# Altium schematic sheet CPU.SchDoc
size A4; SheetNumber: 3; SheetTotal: 11
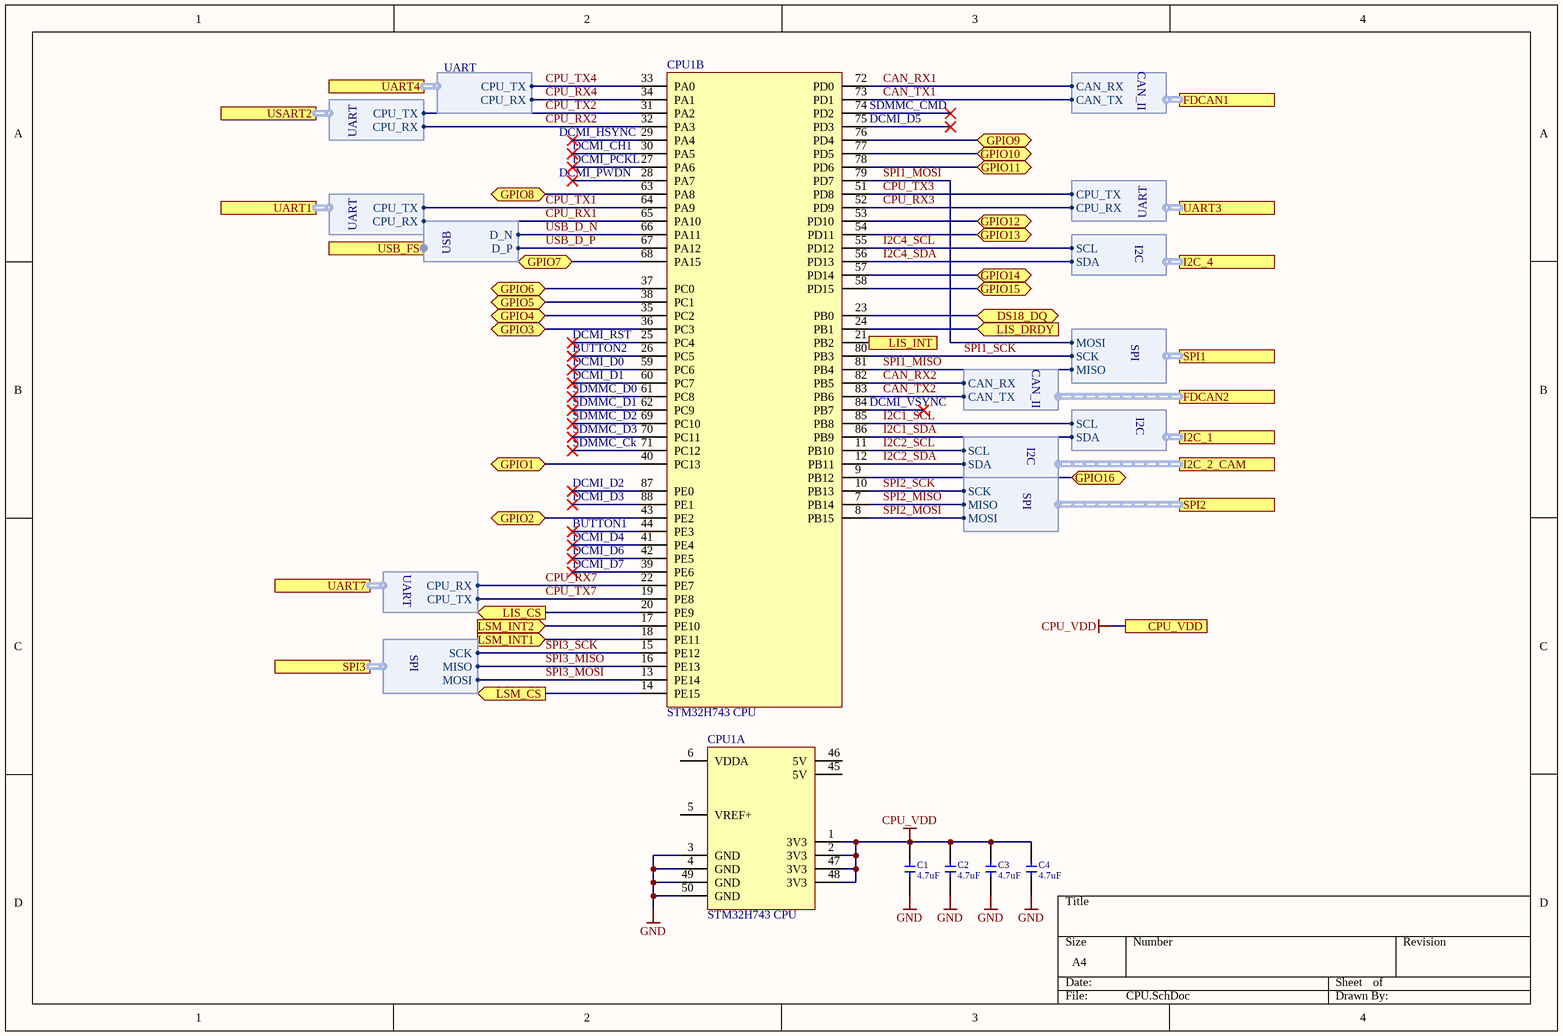
[diagram p0: CPU.SchDoc]

## Parts
C1  value 4.7uF  [CERCAP 0603]
C2  value 4.7uF  [CERCAP 0603]
C3  value 4.7uF  [CERCAP 0603]
C4  value 4.7uF  [CERCAP 0603]
CPU1  STM32H743 CPU  [STM32H7_CPU]  (parts A,B of 2)

## Ports
CPU_VDD, DS18_DQ (bidir), FDCAN1 (harness CAN_II), FDCAN2 (harness CAN_II), GPIO1 (bidir), GPIO2 (bidir), GPIO3 (bidir), GPIO4 (bidir), GPIO5 (bidir), GPIO6 (bidir), GPIO7 (bidir), GPIO8 (bidir), GPIO9 (bidir), GPIO10 (bidir), GPIO11 (bidir), GPIO12 (bidir), GPIO13 (bidir), GPIO14 (bidir), GPIO15 (bidir), GPIO16 (bidir), I2C_1 (harness I2C), I2C_2_CAM (harness I2C), I2C_4 (harness I2C), LIS_CS (out), LIS_DRDY (in), LIS_INT (in), LSM_CS (out), LSM_INT1 (in), LSM_INT2 (in), SPI1 (harness SPI), SPI2 (harness SPI), SPI3 (harness SPI), UART1 (harness UART), UART3 (harness UART), UART4 (harness UART), UART7 (harness UART), USART2 (harness UART), USB_FS (harness USB)

## Harnesses
I2C: SDA, SCL
CAN_II: CAN_RX, CAN_TX
SPI: MOSI, SCK, MISO
USB: D_N, D_P
UART: CPU_RX, CPU_TX

## Nets
CPU_VDD: C1.2 C2.2 C3.2 C4.2 CPU1.1(3V3) CPU1.2(3V3) CPU1.47(3V3) CPU1.48(3V3) ; port CPU_VDD
GND: C1.1 C2.1 C3.1 C4.1 CPU1.3(GND) CPU1.4(GND) CPU1.49(GND) CPU1.50(GND)
CAN_RX1: CPU1.72(PD0) ; port FDCAN1.CAN_RX
CAN_RX2: CPU1.82(PB5) ; port FDCAN2.CAN_RX
CAN_TX1: CPU1.73(PD1) ; port FDCAN1.CAN_TX
CAN_TX2: CPU1.83(PB6) ; port FDCAN2.CAN_TX
CPU_RX1: CPU1.65(PA10) ; port UART1.CPU_RX
CPU_RX2: CPU1.32(PA3) ; port USART2.CPU_RX
CPU_RX3: CPU1.52(PD9) ; port UART3.CPU_RX
CPU_RX4: CPU1.34(PA1) ; port UART4.CPU_RX
CPU_RX7: CPU1.22(PE7) ; port UART7.CPU_RX
CPU_TX1: CPU1.64(PA9) ; port UART1.CPU_TX
CPU_TX2: CPU1.31(PA2) ; port USART2.CPU_TX
CPU_TX3: CPU1.51(PD8) ; port UART3.CPU_TX
CPU_TX4: CPU1.33(PA0) ; port UART4.CPU_TX
CPU_TX7: CPU1.19(PE8) ; port UART7.CPU_TX
DS18_DQ: CPU1.23(PB0) ; port DS18_DQ
GPIO1: CPU1.40(PC13) ; port GPIO1
GPIO2: CPU1.43(PE2) ; port GPIO2
GPIO3: CPU1.36(PC3) ; port GPIO3
GPIO4: CPU1.35(PC2) ; port GPIO4
GPIO5: CPU1.38(PC1) ; port GPIO5
GPIO6: CPU1.37(PC0) ; port GPIO6
GPIO7: CPU1.68(PA15) ; port GPIO7
GPIO8: CPU1.63(PA8) ; port GPIO8
GPIO9: CPU1.76(PD4) ; port GPIO9
GPIO10: CPU1.77(PD5) ; port GPIO10
GPIO11: CPU1.78(PD6) ; port GPIO11
GPIO12: CPU1.53(PD10) ; port GPIO12
GPIO13: CPU1.54(PD11) ; port GPIO13
GPIO14: CPU1.57(PD14) ; port GPIO14
GPIO15: CPU1.58(PD15) ; port GPIO15
GPIO16: CPU1.9(PB12) ; port GPIO16
I2C1_SCL: CPU1.85(PB8) ; port I2C_1.SCL
I2C1_SDA: CPU1.86(PB9) ; port I2C_1.SDA
I2C2_SCL: CPU1.11(PB10) ; port I2C_2_CAM.SCL
I2C2_SDA: CPU1.12(PB11) ; port I2C_2_CAM.SDA
I2C4_SCL: CPU1.55(PD12) ; port I2C_4.SCL
I2C4_SDA: CPU1.56(PD13) ; port I2C_4.SDA
LIS_CS: CPU1.20(PE9) ; port LIS_CS
LIS_DRDY: CPU1.24(PB1) ; port LIS_DRDY
LIS_INT: CPU1.21(PB2) ; port LIS_INT
LSM_CS: CPU1.14(PE15) ; port LSM_CS
LSM_INT1: CPU1.18(PE11) ; port LSM_INT1
LSM_INT2: CPU1.17(PE10) ; port LSM_INT2
SPI1_MISO: CPU1.81(PB4) ; port SPI1.MISO
SPI1_MOSI: CPU1.79(PD7) ; port SPI1.MOSI
SPI1_SCK: CPU1.80(PB3) ; port SPI1.SCK
SPI2_MISO: CPU1.7(PB14) ; port SPI2.MISO
SPI2_MOSI: CPU1.8(PB15) ; port SPI2.MOSI
SPI2_SCK: CPU1.10(PB13) ; port SPI2.SCK
SPI3_MISO: CPU1.16(PE13) ; port SPI3.MISO
SPI3_MOSI: CPU1.13(PE14) ; port SPI3.MOSI
SPI3_SCK: CPU1.15(PE12) ; port SPI3.SCK
USB_D_N: CPU1.66(PA11) ; port USB_FS.D_N
USB_D_P: CPU1.67(PA12) ; port USB_FS.D_P

Not connected (* = marked no-connect by the designer): CPU1 5(VREF+) 6(VDDA) 25(PC4)* 26(PC5)* 27(PA6)* 28(PA7)* 29(PA4)* 30(PA5)* 39(PE6)* 41(PE4)* 42(PE5)* 44(PE3)* 45(5V) 46(5V) 59(PC6)* 60(PC7)* 61(PC8)* 62(PC9)* 69(PC10)* 70(PC11)* 71(PC12)* 74(PD2)* 75(PD3)* 84(PB7)* 87(PE0)* 88(PE1)*

## Notes on the sheet
- (near CPU1) SDMMC_CMD
- (near CPU1) DCMI_HSYNC
- (near CPU1) DCMI_PWDN
- (near CPU1) DCMI_CH1
- (near CPU1) DCMI_PCKL
- (near CPU1) DCMI_D5
- (near CPU1) DCMI_D0
- (near CPU1) DCMI_D1
- (near CPU1) DCMI_RST
- (near CPU1) BUTTON2
- (near CPU1) SDMMC_D0
- (near CPU1) SDMMC_D1
- (near CPU1) SDMMC_D2
- (near CPU1) SDMMC_D3
- (near CPU1) SDMMC_Ck
- (near CPU1) DCMI_VSYNC
- (near CPU1) DCMI_D2
- (near CPU1) DCMI_D3
- (near CPU1) DCMI_D4
- (near CPU1) DCMI_D6
- (near CPU1) DCMI_D7
- (near CPU1) BUTTON1

## Library data of the parts
C1-C4 = !Capacitor: Capacitor; IsSMT: NoSMT; Diel: X7R; Voltage: *
CPU1 = STM32H7 CPU: STM32H743 processor module